# EAGLE design auxboxshield1.56 POT systems  (EAGLE 6.5.0)
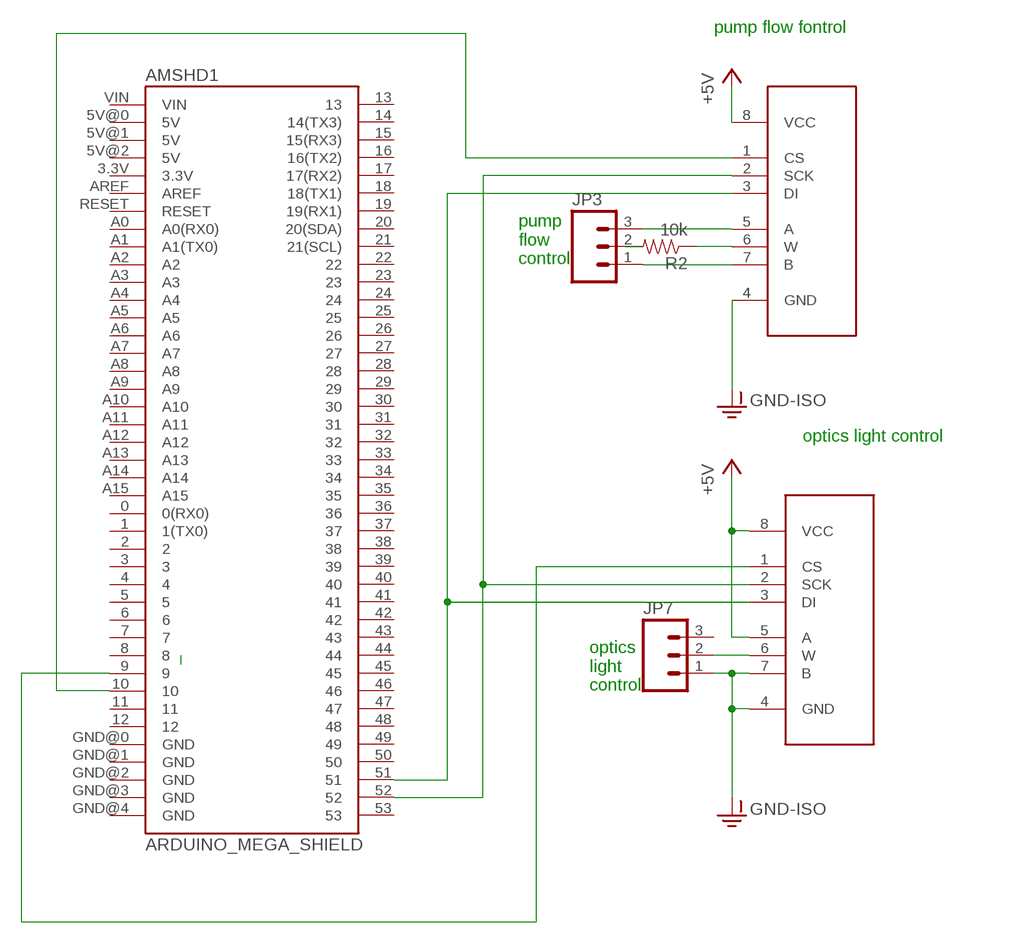
[diagram p0: schematic, sheet 1]

## Parts
AMSHD1  ARDUINO_MEGA_SHIELD  [ARDUINO_MEGA_SHIELD]
JP3  M03POLAR  [MOLEX-1X3]
JP7  M03POLAR  [MOLEX-1X3]
R2  10k  10KOHM-1/4W-1%(PTH)HORIZ  [AXIAL-0.3]
U1  MCP41XXXDIL  [DIL-08]
U2  MCP41XXXDIL  [DIL-08]

## Nets
+5V: U1.5(A) U1.8(VCC) U2.8(VCC)
GND-ISO: JP7.1 U1.4(GND) U1.7(B) U2.4(GND)
N$2: AMSHD1.52 U1.2(SCK) U2.2(SCK)
N$3: AMSHD1.51 U1.3(DI) U2.3(DI)
N$4: AMSHD1.9 U1.1(CS)
N$5: AMSHD1.10 U2.1(CS)
N$21: JP3.3 U2.5(A)
N$24: R2.P$1 U2.6(W)
N$25: JP3.2 R2.P$2
N$32: JP3.1 U2.7(B)
N$35: JP7.2 U1.6(W)
Unconnected: AMSHD1.0(0(RX0)) AMSHD1.1(1(TX0)) AMSHD1.2 AMSHD1.3 AMSHD1.3.3V AMSHD1.4 AMSHD1.5 AMSHD1.5V@0(5V) AMSHD1.5V@1(5V) AMSHD1.5V@2(5V) AMSHD1.6 AMSHD1.7 AMSHD1.8 AMSHD1.11 AMSHD1.12 AMSHD1.13 AMSHD1.14(14(TX3)) AMSHD1.15(15(RX3)) AMSHD1.16(16(TX2)) AMSHD1.17(17(RX2)) AMSHD1.18(18(TX1)) AMSHD1.19(19(RX1)) AMSHD1.20(20(SDA)) AMSHD1.21(21(SCL)) AMSHD1.22 AMSHD1.23 AMSHD1.24 AMSHD1.25 AMSHD1.26 AMSHD1.27 AMSHD1.28 AMSHD1.29 AMSHD1.30 AMSHD1.31 AMSHD1.32 AMSHD1.33 AMSHD1.34 AMSHD1.35 AMSHD1.36 AMSHD1.37 AMSHD1.38 AMSHD1.39 AMSHD1.40 AMSHD1.41 AMSHD1.42 AMSHD1.43 AMSHD1.44 AMSHD1.45 AMSHD1.46 AMSHD1.47 AMSHD1.48 AMSHD1.49 AMSHD1.50 AMSHD1.53 AMSHD1.A0(A0(RX0)) AMSHD1.A1(A1(TX0)) AMSHD1.A2 AMSHD1.A3 AMSHD1.A4 AMSHD1.A5 AMSHD1.A6 AMSHD1.A7 AMSHD1.A8 AMSHD1.A9 AMSHD1.A10 AMSHD1.A11 AMSHD1.A12 AMSHD1.A13 AMSHD1.A14 AMSHD1.A15 AMSHD1.AREF AMSHD1.GND@0(GND) AMSHD1.GND@1(GND) AMSHD1.GND@2(GND) AMSHD1.GND@3(GND) AMSHD1.GND@4(GND) AMSHD1.RESET AMSHD1.VIN JP7.3

## Notes on the sheet
- pump flow fontrol
- pump 
  flow
  control
- optics light control
- optics
  light 
  control

## Library data of the parts
AMSHD1 = SparkFun-Boards:ARDUINO_MEGA_SHIELD
JP3 JP7 = SparkFun-Connectors:M03: Header 3 Standard 3-pin 0.1" header. Use with straight break away headers (SKU : PRT-00116), right angle break away headers (PRT-00553), swiss pins (PRT-00743), machine pins (PRT-00117), and female headers (PRT-00115). Molex polarized connector foot print use with SKU : PRT-08232 with associated crimp pins and housings.
R2 = SparkFun-Resistors:10KOHM-1/4W-1%(PTH): RES-12183; PROD_ID: RES-12183
U1 U2 = SparkFun-AnalogIC:MCP41XXX: SPI controlled single digital potentiometer by Microchip PID: COM-10613

## Board
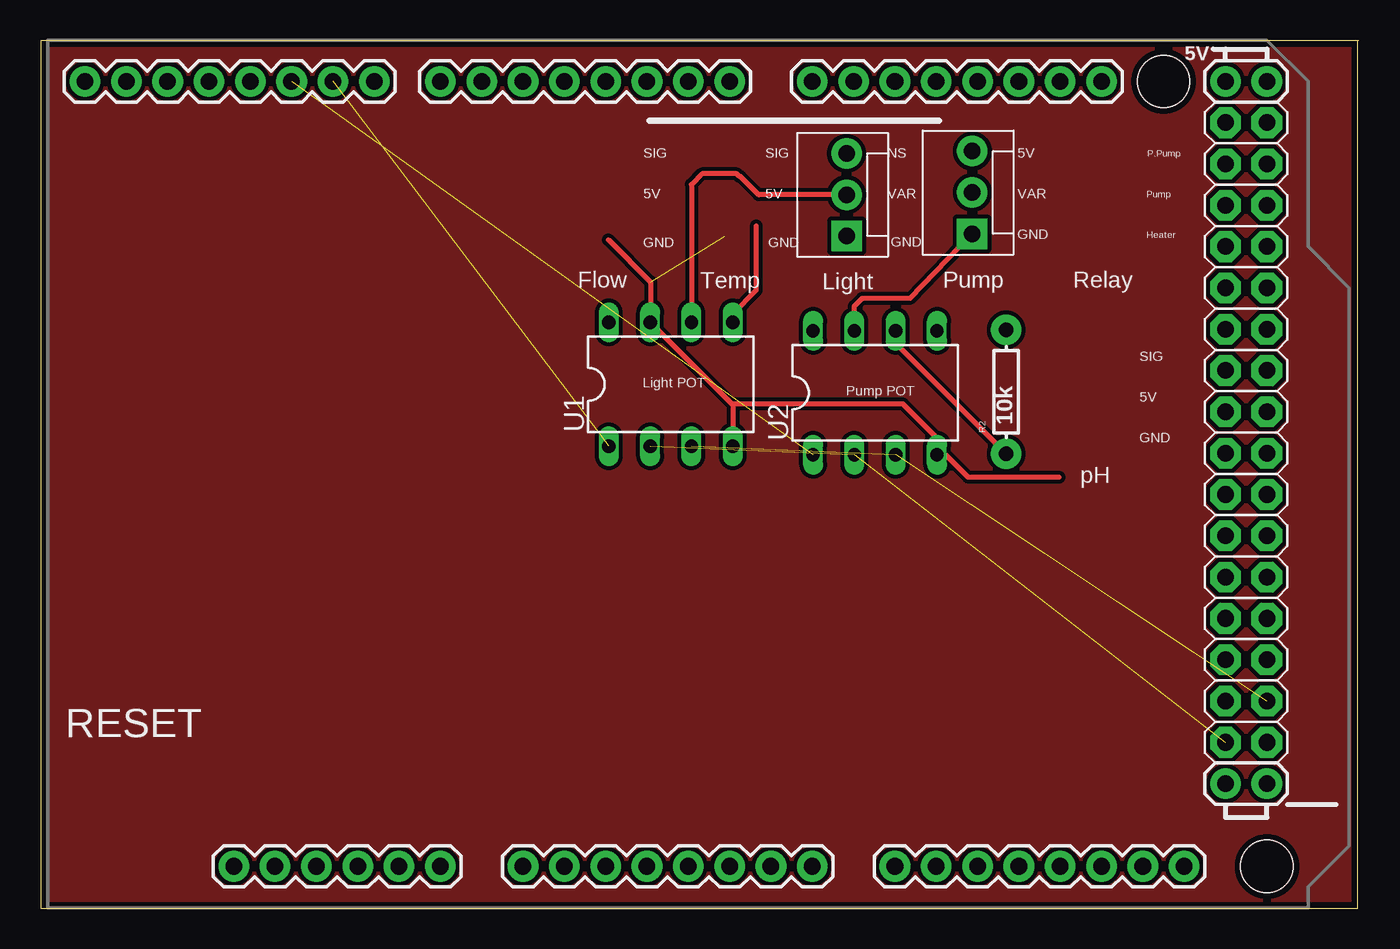
[diagram p1: board, top side]
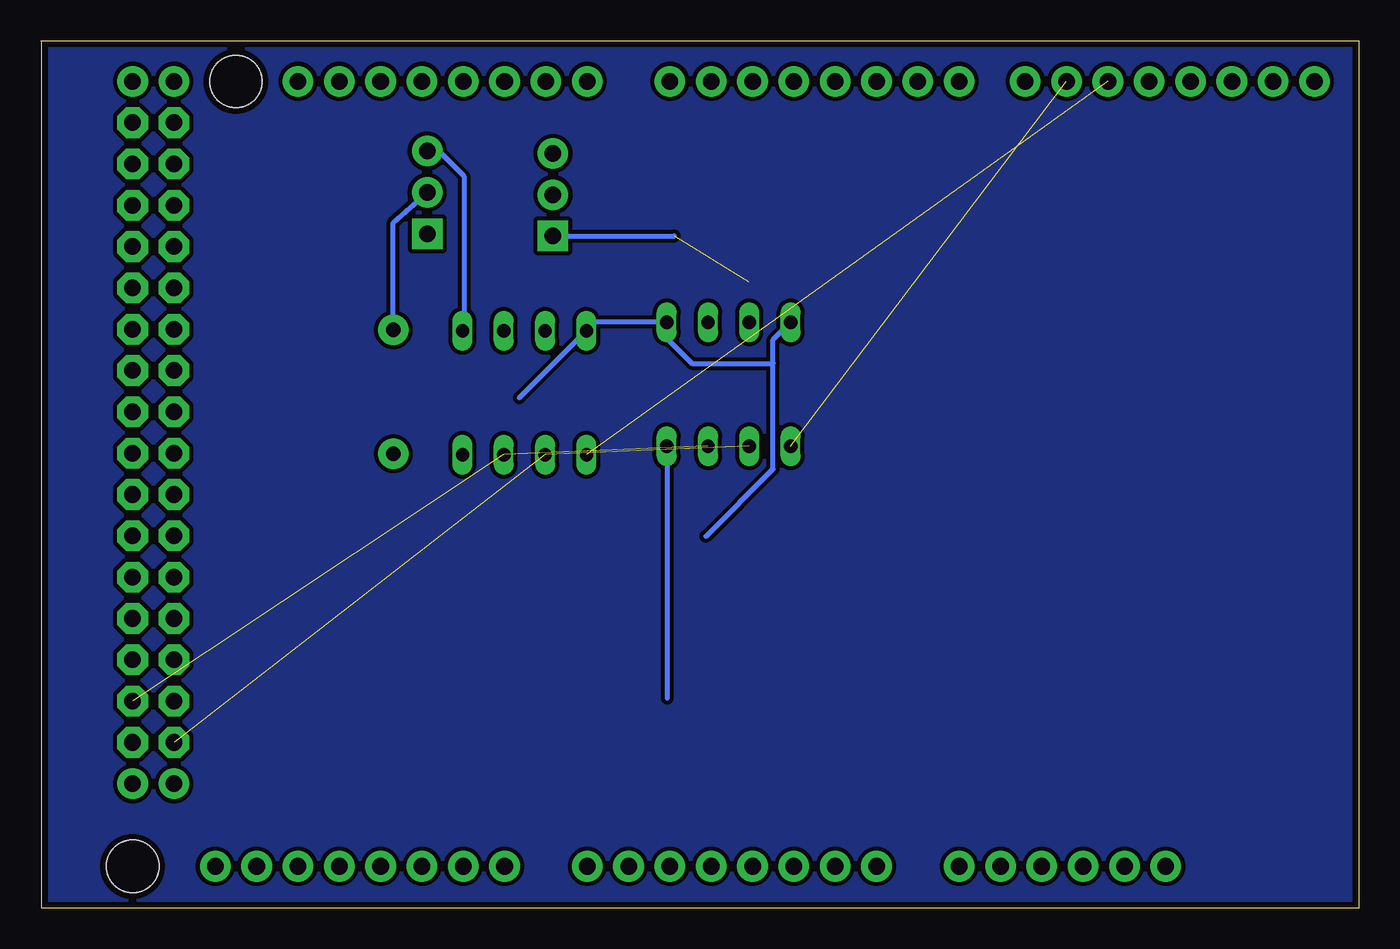
[diagram p2: board, bottom side, seen from below]

Size 81.03 x 53.34 mm. Coordinates in mm from the lower left corner, seen from the top.
Outline: 80.95,53.33 80.95,0 0,0 0,53.33
Outline: 81.03,53.34 0,53.34
Copper layers (1*16): Top 0.0356mm / dielectric 1.5011mm / Bottom 0.0356mm
Design rules "LaenPCBOrder (1)": minimum track width 6mil, minimum drill 13mil, track to track 6mil, track to pad 6mil, pad to pad 6mil, via to via 6mil, smd to smd 6mil, copper to edge 15mil, drill to drill 6mil, minimum pad ring 7mil, minimum via ring 7mil, stop-mask expansion 3mil, vias tented up to drill 0mil, thermal gap 10mil

### Footprints (pad centres in the part's own frame; a part is rotated, then mirrored left to right if it is on the bottom)
ARDUINO_MEGA_SHIELD = drill 1.016 pad 1.88: 0 19.05,27.94; 1 16.51,27.94; 2 13.97,27.94; 3 11.43,27.94; 3.3V -8.89,-20.32; 4 8.89,27.94; 5 6.35,27.94; 5V@0 -6.35,-20.32; 5V@1 49.53,27.94; 5V@2 52.07,27.94; 6 3.81,27.94; 7 1.27,27.94; 8 -2.794,27.94; 9 -5.334,27.94; 10 -7.874,27.94; 11 -10.414,27.94; 12 -12.954,27.94; 13 -15.494,27.94; 14 24.13,27.94; 15 26.67,27.94; 16 29.21,27.94; 17 31.75,27.94; 18 34.29,27.94; 19 36.83,27.94; 20 39.37,27.94; 21 41.91,27.94; A0 6.35,-20.32; A1 8.89,-20.32; A2 11.43,-20.32; A3 13.97,-20.32; A4 16.51,-20.32; A5 19.05,-20.32; A6 21.59,-20.32; A7 24.13,-20.32; A8 29.21,-20.32; A9 31.75,-20.32; A10 34.29,-20.32; A11 36.83,-20.32; A12 39.37,-20.32; A13 41.91,-20.32; A14 44.45,-20.32; A15 46.99,-20.32; AREF -20.574,27.94; GND@0 -3.81,-20.32; GND@1 -1.27,-20.32; GND@2 49.53,-15.24; GND@3 52.07,-15.24; GND@4 -18.034,27.94; RESET -11.43,-20.32; VIN 1.27,-20.32 | drill 1.016 pad 1.88 octagon: 22 49.53,25.4; 23 52.07,25.4; 24 49.53,22.86; 25 52.07,22.86; 26 49.53,20.32; 27 52.07,20.32; 28 49.53,17.78; 29 52.07,17.78; 30 49.53,15.24; 31 52.07,15.24; 32 49.53,12.7; 33 52.07,12.7; 34 49.53,10.16; 35 52.07,10.16; 36 49.53,7.62; 37 52.07,7.62; 38 49.53,5.08; 39 52.07,5.08; 40 49.53,2.54; 41 52.07,2.54; 42 49.53,0; 43 52.07,0; 44 49.53,-2.54; 45 52.07,-2.54; 46 49.53,-5.08; 47 52.07,-5.08; 48 49.53,-7.62; 49 52.07,-7.62; 50 49.53,-10.16; 51 52.07,-10.16; 52 49.53,-12.7; 53 52.07,-12.7 | hole 3.2: 45.72,27.94; 52.07,-20.32
MOLEX-1X3 = drill 1.016 pad 1.88 square: 1 0,0 | drill 1.016 pad 1.88: 2 2.54,0; 3 5.08,0
AXIAL-0.3 = drill 0.9 pad 1.88: P$1 -3.81,0; P$2 3.81,0
DIL-08 = drill 0.813 long: 1 -3.81,-3.81; 2 -1.27,-3.81; 3 1.27,-3.81; 4 3.81,-3.81; 5 3.81,3.81; 6 1.27,3.81; 7 -1.27,3.81; 8 -3.81,3.81

### Placement (x,y rotation side)
AMSHD1  23.3,22.9 0 top
JP3  57.26,41.47 90 top
JP7  49.54,41.33 90 top
R2  59.35,31.75 90 top
U1  38.73,32.22 0 top
U2  51.29,31.69 0 top

### Tracks (layer width: path | path; a pad name or v marks a point on that pad's centre or on a via)
+5V
  Top 0.305: U1.5 42.55,36.55 44,38 44,41.94
  Bottom 0.305: 51.59,31.39 U2.8 46.95,36.02 U1.5 42.55,35.05 41,33.5 36,33.5 | 40.14,22.86 36,27 36,33.5 | 36,33.5 36,34.95 U1.8
GND
  pour Bottom (isolate 0.254): 0,53.5 81,53.5 81,0 0,0
GND-ISO  (1 unrouted)
  Top 0.305: 42.5,28.36 U1.4 42.55,30.95 42.49,31 | 62.6,26.5 57,26.5 55.62,27.88 U2.4 55.1,28.9 53,31 42.49,31 | 42.49,31 U1.7 37.5,36.06 37.5,38.5 34.9,41.1
  Bottom 0.305: JP7.1 42.07,41.33 | 42.5,12.92 42.5,28.36 U1.4
N$2  (2 unrouted)
N$3  (2 unrouted)
N$4  (1 unrouted)
N$5  (1 unrouted)
N$8
  pour Top (isolate 0.254): 0.5,53 80.5,53 80.5,0.5 0.5,0.5
N$21
  Bottom 0.305: JP3.3 56.58,46.58 55,45 55,35.6 U2.5
N$24
  Top 0.305: U2.6 52.56,34.73 R2.P$1
N$25
  Bottom 0.305: R2.P$2 59.35,42.14 JP3.2
N$32
  Top 0.305: U2.7 50.02,37.02 50.5,37.5 53.45,37.5 JP3.1
N$35
  Top 0.305: JP7.2 44.13,43.87 43,45 42.94,45 42.78,45.16 40.66,45.16 40,44.5 U1.6

### Text on the board
tPlace: SIG | SIG | NS | 5V | P.Pump | 5V | 5V | VAR | VAR | Pump | GND | GND | GND | GND | Heater | Flow | Temp | Light | Pump | Relay | SIG | Light POT | Pump POT | 5V | GND | pH | RESET
DrillLegend_01-16: 01-16